# Altium schematic sheet Sheet2.SchDoc
size A4
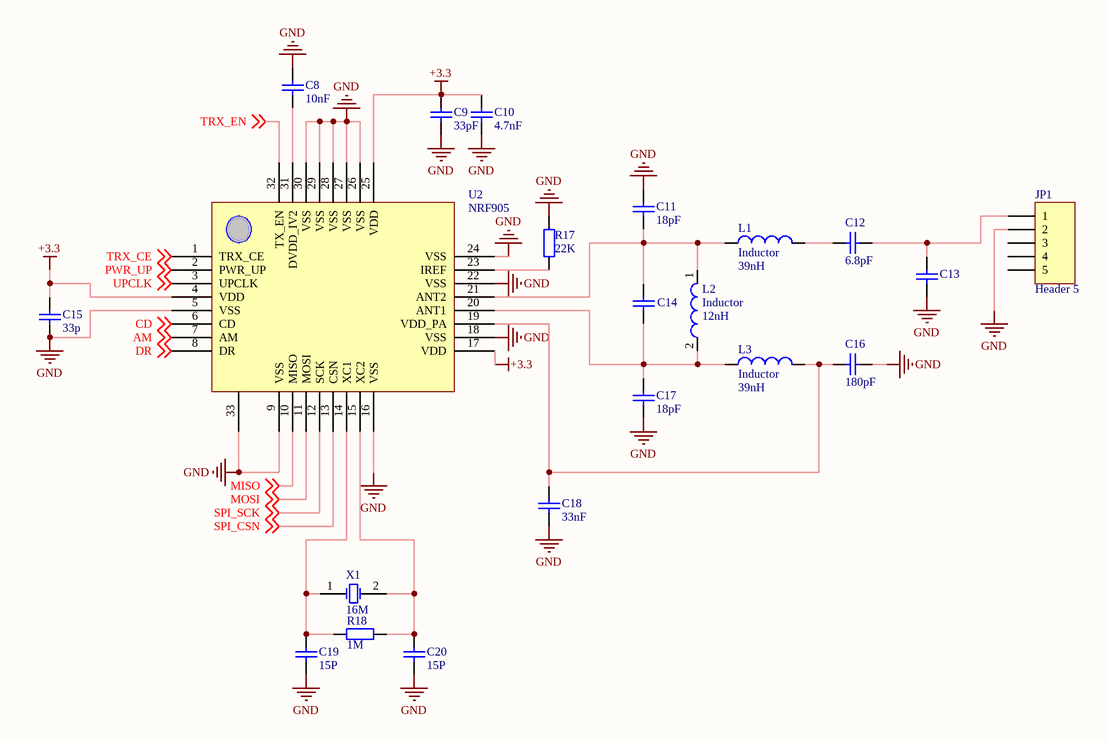
[diagram p0: Sheet2.SchDoc]

## Parts
C8  10nF  [0603C]
C9  33pF  [0603C]
C10  4.7nF  [0603C]
C11  18pF  [0603C]
C12  6.8pF  [0603C]
C13  (no value)  [0603C]
C14  (no value)  [0603C]
C15  33p  [0603C]
C16  180pF  [0603C]
C17  18pF  [0603C]
C18  33nF  [0603C]
C19  15P  [0603C]
C20  15P  [0603C]
JP1  Header 5  [SMA]
L1  Inductor  value 39nH  [0603]
L2  Inductor  value 12nH  [0603]
L3  Inductor  value 39nH  [0603]
R17  22K  [0603R]
R18  1M  [0603R]
U2  NRF905  [QFN32_M]
X1  16M  [CY2]

## Nets
+3.3: C9.2 C10.2 C15.2 U2.4(VDD) U2.17(VDD) U2.25(VDD)
GND: C8.2 C9.1 C10.1 C11.2 C13.1 C15.1 C16.1 C17.1 C18.1 C19.1 C20.1 JP1.2 R17.2 U2.5(VSS) U2.9(VSS) U2.16(VSS) U2.18(VSS) U2.22(VSS) U2.24(VSS) U2.26(VSS) U2.27(VSS) U2.28(VSS) U2.29(VSS) U2.30(VSS) U2.33
AM: U2.7(AM) ; off-sheet AM
CD: U2.6(CD) ; off-sheet CD
DR: U2.8(DR) ; off-sheet DR
MISO: U2.10(MISO) ; off-sheet MISO
MOSI: U2.11(MOSI) ; off-sheet MOSI
PWR_UP: U2.2(PWR_UP) ; off-sheet PWR_UP
SPI_CSN: U2.13(CSN) ; off-sheet SPI_CSN
SPI_SCK: U2.12(SCK) ; off-sheet SPI_SCK
TRX_CE: U2.1(TRX_CE) ; off-sheet TRX_CE
TRX_EN: U2.32(TX_EN) ; off-sheet TRX_EN
UPCLK: U2.3(UPCLK) ; off-sheet UPCLK
NetC8_1: C8.1 U2.31(DVDD_IV2)
NetC11_1: C11.1 C14.2 L1.1 L2.1 U2.21(ANT2)
NetC12_1: C12.1 C13.2 JP1.1
NetC12_2: C12.2 L1.2
NetC14_1: C14.1 C17.2 L2.2 L3.1 U2.20(ANT1)
NetC16_2: C16.2 C18.2 L3.2 U2.19(VDD_PA)
NetC19_2: C19.2 R18.1 U2.14(XC1) X1.1(OSC1)
NetC20_2: C20.2 R18.2 U2.15(XC2) X1.2(OSC2)
NetR17_1: R17.1 U2.23(IREF)

Not connected (* = marked no-connect by the designer): JP1 3 4 5

## Library data of the parts
C8-C20 = Cap: Capacitor; Value: 4700pF; Published: 8-Jun-2000; LatestRevisionDate: 17-Jul-2002; LatestRevisionNote: Re-released for DXP Platform.; PackageReference: RAD-0.3; Publisher: Altium Limited; PackageDescription: Radial Cap, Thru-Hole; 2 Leads; 0.3 in Pin Spacing
JP1 = Header 5: Header, 5-Pin; LatestRevisionDate: 17-Jul-2002; LatestRevisionNote: Re-released for DXP Platform.; Publisher: Altium Limited
L1-L3 = Inductor: Code_IEC: 1005; Published: 8-Jun-2000; LatestRevisionDate: 29-May-2009; LatestRevisionNote: IPC-7351 Footprint Added.; PackageReference: 0402-A; Publisher: Altium Limited; PackageDescription: Chip Inductor; Code_JEITA: 0402
R17 R18 = Res2: Resistor; Value: 50K; Published: 8-Jun-2000; LatestRevisionDate: 17-Jul-2002; LatestRevisionNote: Re-released for DXP Platform.; PackageReference: AXIAL-0.4; Publisher: Altium Limited; PackageDescription: Axial Device, Thru-Hole; 2 Leads; 0.4 in Pin Spacing
X1 = XTAL: Crystal Oscillator; Published: 8-Jun-2000; LatestRevisionDate: 17-Jul-2002; LatestRevisionNote: Re-released for DXP Platform.; PackageReference: R38; Publisher: Altium Limited; PackageDescription: Crystal, Thru-Hole; 2 Leads; Body 3.1 x 8.2 mm (Dia.xH)